# Altium schematic sheet 4_CONN.schdoc
size 431 x 309 mm; Symbol: Sheet-Symbol_A3; Device: Sheet-Symbol_A3; @Page Name: connection.HV582双路模块H7主控 copy; @Create Date: 2023-07-31; @Page Count: 4; @Page No: 4; @Project Name: DM lite opensource board A2A V1.0; @Schematic Name: HV582双路模块H7主控 copy; @Update Date: 2023-08-08; Company: 嘉立创EDA; Page Size: A3; Version: V1.0
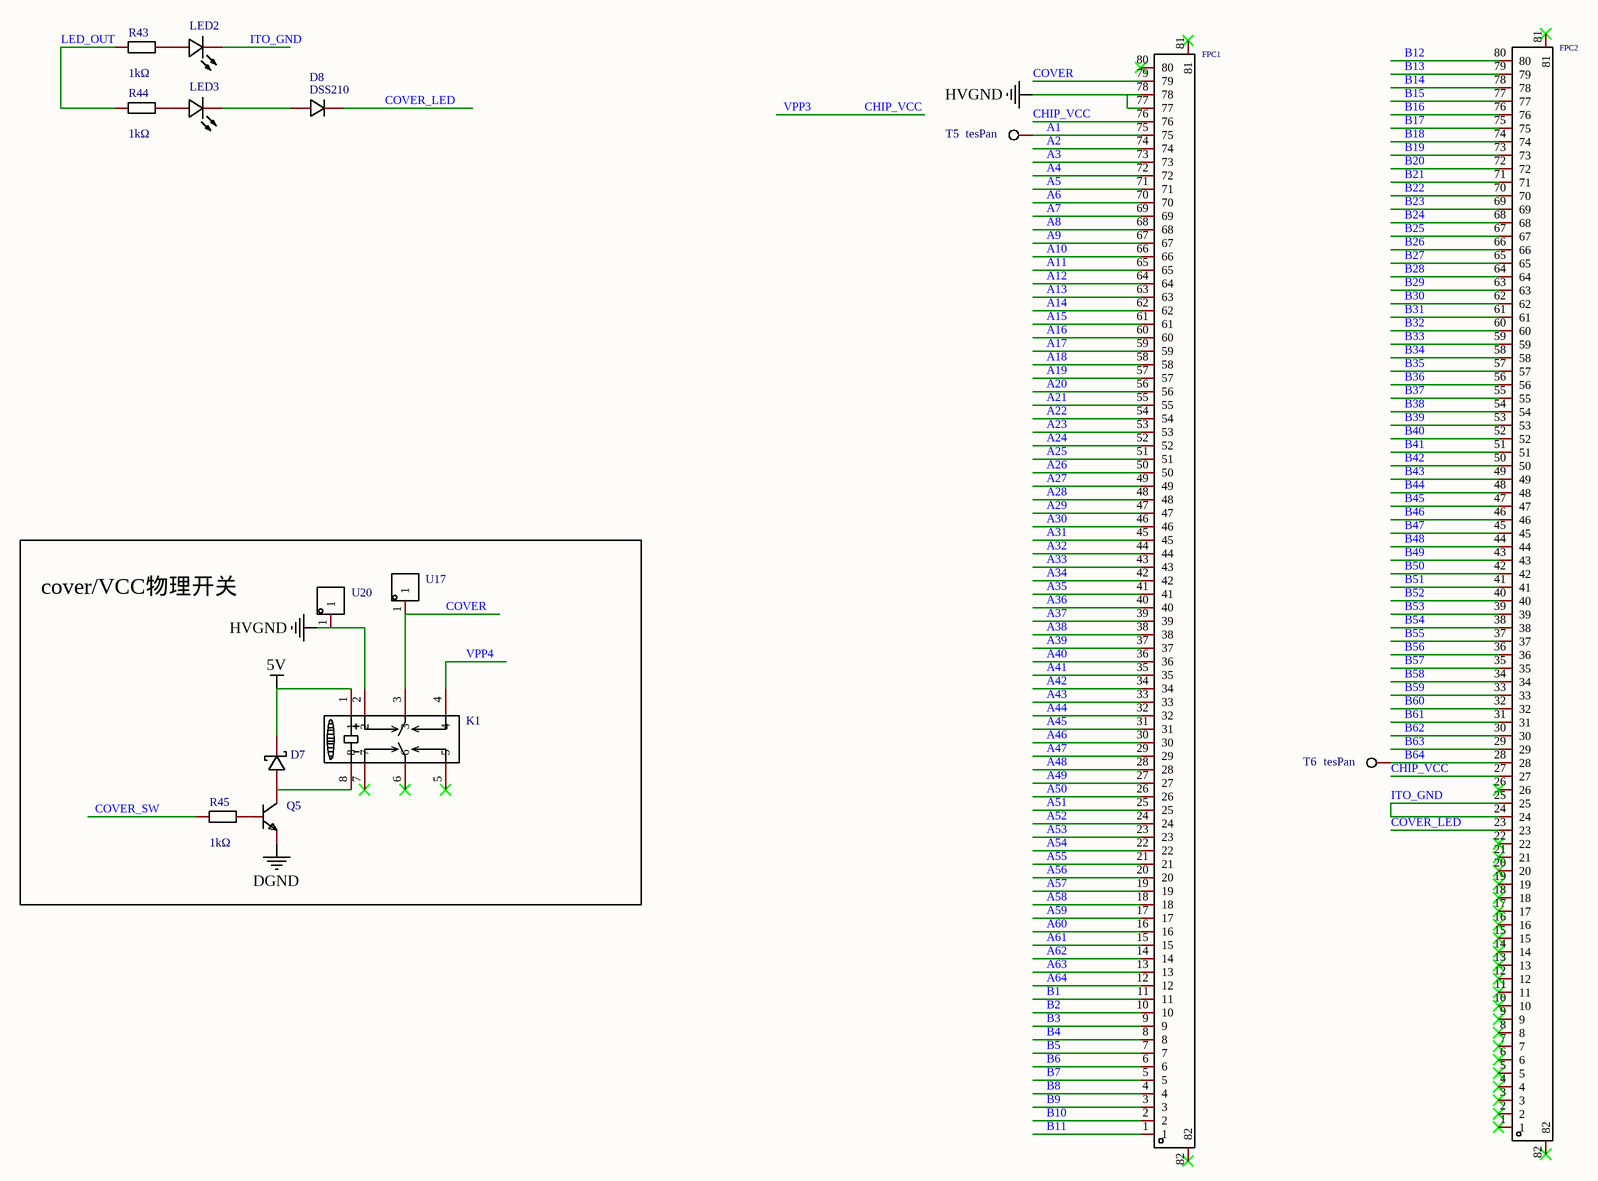
[diagram p0: 4_CONN.schdoc]

## Parts
D7  B5819W SL  [SOD-123_L2.7-W1.6-LS3.7-RD-1]  (value not drawn)
D8  DSS210  [SOD-123_L2.8-W1.8-LS3.7-FD]
FPC1  FH28H-80S-0.5SH(05)  [FFC-SMD_80P-P0.50_FH28H-80S-0.5SH]  (value not drawn)
FPC2  FH28H-80S-0.5SH(05)  [FFC-SMD_80P-P0.50_FH28H-80S-0.5SH]  (value not drawn)
K1  G6K-2F-Y-TR DC5  [RELAY-SMD_G6K-2F-X-XX]  (value not drawn)
LED2  LED0402-YELLOW  [LED0402-RD_YELLOW]  (value not drawn)
LED3  LED0402-YELLOW  [LED0402-RD_YELLOW]  (value not drawn)
Q5  S8050 J3Y_C2146  [SOT-23-3_L3.0-W1.7-P0.95-LS2.9-BR]  (value not drawn)
R43  value 1kΩ  [R0402]  (hidden comment: 0402WGF1001TCE)
R44  value 1kΩ  [R0402]  (hidden comment: 0402WGF1001TCE)
R45  value 1kΩ  [R0402]  (hidden comment: 0402WGF1001TCE)
T5  tesPan  [测试点]
T6  tesPan  [测试点]
U17  5003  [TEST-TH_BD2.54-P1.39]  (value not drawn)
U20  5003  [TEST-TH_BD2.54-P1.39]  (value not drawn)

## Blocks framed on the sheet
cover/VCC物理开关: D7 K1 Q5 R45 U17 U20

## Nets
5V: D7.1(-) K1.1
DGND: Q5.2(E)
HVGND: FPC1.77 FPC1.78 K1.2 U20.1
A1: FPC1.75 T5.1
A2: FPC1.74
A3: FPC1.73
A4: FPC1.72
A5: FPC1.71
A6: FPC1.70
A7: FPC1.69
A8: FPC1.68
A9: FPC1.67
A10: FPC1.66
A11: FPC1.65
A12: FPC1.64
A13: FPC1.63
A14: FPC1.62
A15: FPC1.61
A16: FPC1.60
A17: FPC1.59
A18: FPC1.58
A19: FPC1.57
A20: FPC1.56
A21: FPC1.55
A22: FPC1.54
A23: FPC1.53
A24: FPC1.52
A25: FPC1.51
A26: FPC1.50
A27: FPC1.49
A28: FPC1.48
A29: FPC1.47
A30: FPC1.46
A31: FPC1.45
A32: FPC1.44
A33: FPC1.43
A34: FPC1.42
A35: FPC1.41
A36: FPC1.40
A37: FPC1.39
A38: FPC1.38
A39: FPC1.37
A40: FPC1.36
A41: FPC1.35
A42: FPC1.34
A43: FPC1.33
A44: FPC1.32
A45: FPC1.31
A46: FPC1.30
A47: FPC1.29
A48: FPC1.28
A49: FPC1.27
A50: FPC1.26
A51: FPC1.25
A52: FPC1.24
A53: FPC1.23
A54: FPC1.22
A55: FPC1.21
A56: FPC1.20
A57: FPC1.19
A58: FPC1.18
A59: FPC1.17
A60: FPC1.16
A61: FPC1.15
A62: FPC1.14
A63: FPC1.13
A64: FPC1.12
B1: FPC1.11
B2: FPC1.10
B3: FPC1.9
B4: FPC1.8
B5: FPC1.7
B6: FPC1.6
B7: FPC1.5
B8: FPC1.4
B9: FPC1.3
B10: FPC1.2
B11: FPC1.1
B12: FPC2.80
B13: FPC2.79
B14: FPC2.78
B15: FPC2.77
B16: FPC2.76
B17: FPC2.75
B18: FPC2.74
B19: FPC2.73
B20: FPC2.72
B21: FPC2.71
B22: FPC2.70
B23: FPC2.69
B24: FPC2.68
B25: FPC2.67
B26: FPC2.66
B27: FPC2.65
B28: FPC2.64
B29: FPC2.63
B30: FPC2.62
B31: FPC2.61
B32: FPC2.60
B33: FPC2.59
B34: FPC2.58
B35: FPC2.57
B36: FPC2.56
B37: FPC2.55
B38: FPC2.54
B39: FPC2.53
B40: FPC2.52
B41: FPC2.51
B42: FPC2.50
B43: FPC2.49
B44: FPC2.48
B45: FPC2.47
B46: FPC2.46
B47: FPC2.45
B48: FPC2.44
B49: FPC2.43
B50: FPC2.42
B51: FPC2.41
B52: FPC2.40
B53: FPC2.39
B54: FPC2.38
B55: FPC2.37
B56: FPC2.36
B57: FPC2.35
B58: FPC2.34
B59: FPC2.33
B60: FPC2.32
B61: FPC2.31
B62: FPC2.30
B63: FPC2.29
B64: FPC2.28 T6.1
CHIP_VCC: FPC1.76 FPC2.27  [also labelled VPP3]
COVER: FPC1.79 K1.3 U17.1
COVER_LED: D8.2(K) FPC2.23
COVER_SW: R45.1
ITO_GND: FPC2.24 FPC2.25 LED2.1(-)
LED_OUT: R43.1 R44.1
VPP4: K1.4
NetD7_2: D7.2(+) K1.8 Q5.3(C)
NetD8_1: D8.1(A) LED3.1(-)
NetLED2_2: LED2.2(+) R43.2
NetLED3_2: LED3.2(+) R44.2
NetQ5_1: Q5.1(B) R45.2

Not connected (* = marked no-connect by the designer): FPC1 80* 81* 82*; FPC2 1* 2* 3* 4* 5* 6* 7* 8* 9* 10* 11* 12* 13* 14* 15* 16* 17* 18* 19* 20* 21* 22* 26* 81* 82*; K1 5* 6* 7*

## Notes on the sheet
- 1
- 2
- 3
- 4
- 5
- 6
- A
- B
- C
- 原理图
- HV582双路模块H7主控 copy
- 创建日期
- 更新日期
- 2023-07-31
- 2023-08-08
- D
- 审阅
- 绘制
- 图页
- connection.HV582双路模块H7主控 copy
- 物料编码
- DM lite opensource board A2A V1.0
- 版本
- 尺寸
- 页
- 共
- V1.0
- A3
- 嘉立创EDA

## Library data of the parts
D7 = B5819W SL: 直流反向耐压(Vr):40V;平均整流电流(Io):1A;正向压降(Vf):600mV@1A;; Manufacturer: CJ(江苏长电/长晶); Symbol: B5819W_C8598; Add into BOM: yes; Reverse Voltage (Vr): 40V; Average Rectified Current (Io): 1A; Name: B5819W SL; Device: B5819W SL; LCSC Part Name: 40V 1A 600mV@1A; Supplier Part: C8598; Manufacturer Part: B5819W SL; Supplier Footprint: SOD-123; JLCPCB Part Class: 基础库; Datasheet: https://atta.szlcsc.com/upload/public/pdf/source/20170217/1487301580783.pdf; Supplier: LCSC; Convert to PCB: yes; Forward Voltage (Vf@If): 600mV@1A
D8 = DSS210_SOD-123_L2.8-W1.8-LS3.7-FD: Manufacturer: Bourne Semicon (Shenzhen); Convert to PCB: yes; Name: DSS210; Symbol: DSS210; Device: DSS210_SOD-123_L2.8-W1.8-LS3.7-FD; Supplier: LCSC; Supplier Part: C511868; Manufacturer Part: DSS210; JLCPCB Part Class: Extended Part; Add into BOM: yes; Origin Footprint: SOD-123_L2.8-W1.8-LS3.7-FD
FPC1 FPC2 = FH28H-80S-0.5SH(05): 间距:0.5mm;触点数量:80;锁定特性:翻盖式;安装类型:卧贴;触点类型:下接;; Manufacturer: HRS(广濑); Add into BOM: yes; Pitch: 0.5mm; Number of Contacts: 80; Locking Feature: 翻盖式; FFC, FCB Thickness: 0.3mm; Name: FH28H-80S-0.5SH(05); Symbol: FH28H-80S-0.5SH(05); Device: FH28H-80S-0.5SH(05); LCSC Part Name: FPC,ZIF,FH28系列,0.5间距,80PIN; Supplier Part: C424679; Manufacturer Part: FH28H-80S-0.5SH(05); Supplier Footprint: SMD,P=0.5mm; JLCPCB Part Class: 扩展库; Supplier: LCSC; Convert to PCB: yes; Mounting Type: 卧贴; Contact Type: 下接; Height Above Board: 2.54mm
K1 = G6K-2F-Y-TR DC5: 线圈电压:-;触点形式:-;最大切换电压:-;最大切换电流:-;线圈类型:-;触点材料:-;; Manufacturer: OMRON(欧姆龙); Symbol: G6K-2F-Y-DC5; Add into BOM: yes; Name: G6K-2F-Y-TR DC5; Device: G6K-2F-Y-TR DC5; LCSC Part Name: G6K-2F-Y-TR DC5; Supplier Part: C47190; Manufacturer Part: G6K-2F-Y-TR DC5; Supplier Footprint: SMD,6.5x10mm; JLCPCB Part Class: 扩展库; Datasheet: https://atta.szlcsc.com/upload/public/pdf/source/20220125/C1876770_53E5491D4B68F29C4BBD8118E9BAE0E8.pdf; Supplier: LCSC; Convert to PCB: yes; Pin Number: -; Coil Voltage: -; Coil Rated Power: -; Contact Form: -; Contact Rating: -; Coil Resistance: -; Maximum Switching Voltage: -; Maximum Switching Current: -; Operate Time: -; Release Time: -; Coil Type: -; Contact Resistance: -; Contact Material: -; Operating Temperature: -
LED2 LED3 = LED0402-YELLOW: Add into BOM: yes; Name: LED0402-YELLOW; Symbol: LED0402-YELLOW; Device: LED0402-YELLOW; LCSC Part Name: LED0402-YELLOW; Supplier Part: C9900022539; Manufacturer Part: LED0402-YELLOW; Supplier Footprint: LED0402; JLCPCB Part Class: 扩展库; Datasheet: https://atta.szlcsc.comnull; Supplier: LCSC; Convert to PCB: yes
Q5 = S8050 J3Y_C2146: 晶体管类型:NPN;集射极击穿电压(Vceo):25V;集电极电流(Ic):500mA;功率(Pd):300mW;集电极截止电流(Icbo):100nA;集电极-发射极饱和电压(VCE(sat)@Ic,Ib):600mV@500mA,50mA;直流电流增益(hFE@Ic,Vce):200@50mA,1V;特征频率(fT):150MHz;工作温度:+150℃@(Tj);; Manufacturer: CJ(江苏长电/长晶); Symbol: S8050_C2146; Add into BOM: yes; Transistor Type: NPN; Collector-Emitter Breakdown Voltage (Vceo): 25V; Collector Current (Ic): 500mA; Power Dissipation (Pd): 300mW; Collector Cut-Off Current (Icbo): 100nA; Transition Frequency (fT): 150MHz; NAME: E; NUMBER: 2; Name: S8050 J3Y; Device: S8050 J3Y_C2146; LCSC Part Name: NPN 25V 500mA (200-350); Supplier Part: C2146; Manufacturer Part: S8050 J3Y; Supplier Footprint: SOT-23; JLCPCB Part Class: 基础库; Datasheet: https://atta.szlcsc.com/upload/public/pdf/source/20140809/1457707209234.pdf; Supplier: LCSC; Convert to PCB: yes; Collector-Emitter Saturation Voltage (VCE(sat)@Ic,Ib): 600mV@500mA,50mA; DC Current Gain (hFE@Ic,Vce): 200@50mA,1V; Operating Temperature: +150℃@(Tj)
R43-R45 = 0402WGF1001TCE: 电阻类型:厚膜电阻;阻值:1kΩ;精度:±1%;功率:62.5mW;; Manufacturer: UNI-ROYAL(厚声); Add into BOM: yes; Tolerance: ±1%; Power(Watts): 62.5mW; Temperature Coefficient: ±100ppm/℃; Overload Voltage (Max): 50V; Name: 1kΩ; Symbol: 0402WGF1001TCE; Device: 0402WGF1001TCE; LCSC Part Name: 1kΩ ±1% 62.5mW; Supplier Part: C11702; Manufacturer Part: 0402WGF1001TCE; Supplier Footprint: 0402; JLCPCB Part Class: 基础库; Datasheet: https://atta.szlcsc.com/upload/public/pdf/source/20200306/C422600_1E6D84923E4A46A82E41ADD87F860B5C.pdf; Supplier: LCSC; Convert to PCB: yes; Type: 厚膜电阻; Operating Temperature Range: -55℃~+155℃
T5 T6 = tesPan: Convert to PCB: yes; Name: tesPan; Symbol: tesPan; Device: tesPan; Supplier Part: undefined; Add into BOM: yes; Origin Footprint: 测试点
U17 U20 = 5003: 类型:测试环;全长/全高:7.62mm;工作高度:-;接触电阻:-;弹性寿命:-;额定电流:-;额定电压:-;触头材质:磷青铜;触头镀层:-;工作温度范围:-;; Manufacturer: Keystone; Add into BOM: yes; Overall Length/Height: 7.62mm; Name: 5003; Symbol: 5003; Device: 5003; LCSC Part Name: 5003; Supplier Part: C238124; Manufacturer Part: 5003; Supplier Footprint: -; JLCPCB Part Class: 扩展库; Datasheet: https://atta.szlcsc.com/upload/public/pdf/source/20180629/C238124_11BD2E2A2950E8BDAC768C438ECF8773.PDF; Supplier: LCSC; Convert to PCB: yes; Type: 测试环; Operational Height: -; Contact Resistance: -; Elastic Life: -; Rated Current: -; Rated Voltage: -; Contact Material: 磷青铜; Contact Plating: -; Operating Temperature Range: -